# Altium schematic sheet INTERFACE_rev2.SchDoc
size A4; SheetNumber: 7; SheetTotal: 11
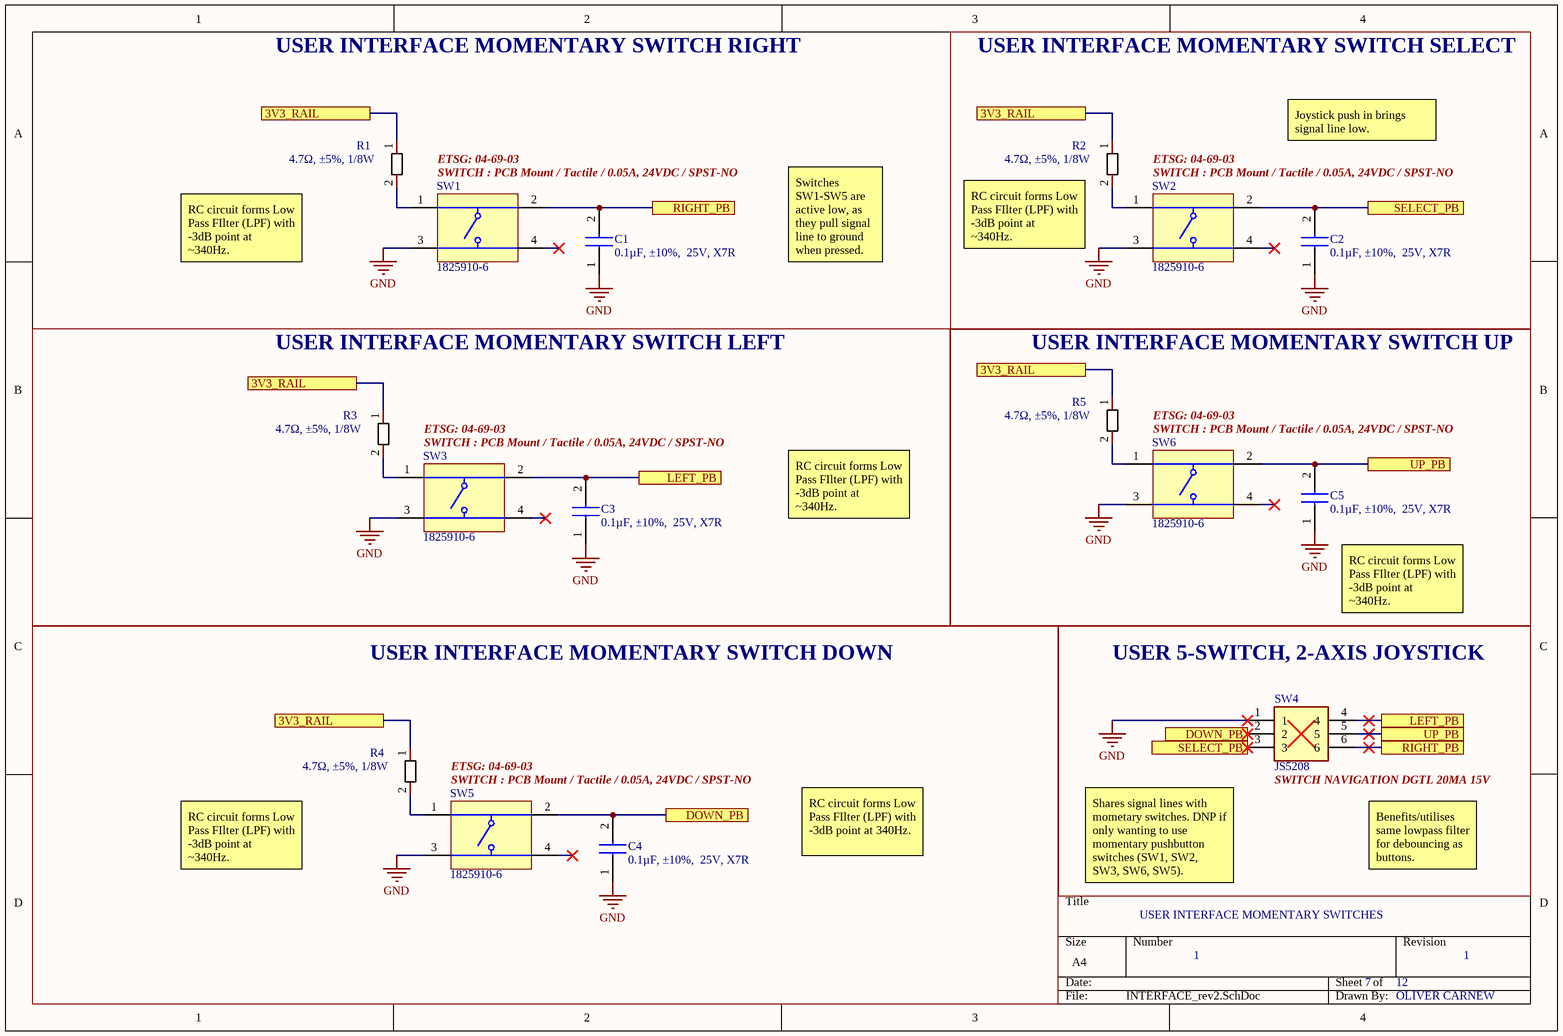
[diagram p0: INTERFACE_rev2.SchDoc]

## Parts
*  NC  (value not drawn)
C1  0.1µF, ±10%,  25V, X7R  [CAPC1005X55N]
C2  0.1µF, ±10%,  25V, X7R  [CAPC1005X55N]
C3  0.1µF, ±10%,  25V, X7R  [CAPC1005X55N]
C4  0.1µF, ±10%,  25V, X7R  [CAPC1005X55N]
C5  0.1µF, ±10%,  25V, X7R  [CAPC1005X55N]
R1  4.7Ω, ±5%, 1/8W  [SURFM RESISTOR]
R2  4.7Ω, ±5%, 1/8W  [SURFM RESISTOR]
R3  4.7Ω, ±5%, 1/8W  [SURFM RESISTOR]
R4  4.7Ω, ±5%, 1/8W  [SURFM RESISTOR]
R5  4.7Ω, ±5%, 1/8W  [SURFM RESISTOR]
SW1  1825910-6  [TECO-1825910-6_V]
SW2  1825910-6  [TECO-1825910-6_V]
SW3  1825910-6  [TECO-1825910-6_V]
SW4  JS5208  [JS5208]
SW5  1825910-6  [TECO-1825910-6_V]
SW6  1825910-6  [TECO-1825910-6_V]

## Blocks framed on the sheet
USER INTERFACE MOMENTARY SWITCH SELECT: C2 R2 SW2
USER INTERFACE MOMENTARY SWITCH LEFT: C3 R3 SW3
USER INTERFACE MOMENTARY SWITCH UP: C5 R5 SW6
USER INTERFACE MOMENTARY SWITCH DOWN: C4 R4 SW5
USER 5-SWITCH, 2-AXIS JOYSTICK: * SW4

## Ports
3V3_RAIL, DOWN_PB, LEFT_PB, RIGHT_PB, SELECT_PB, UP_PB

## Nets
GND: C1.1 C2.1 C3.1 C4.1 C5.1 SW1.3 SW2.3 SW3.3 SW4.1 SW5.3 SW6.3
3V3_RAIL: R1.1 R2.1 R3.1 R4.1 R5.1 ; port 3V3_RAIL
DOWN_PB: C4.2 SW4.2 SW5.2 ; port DOWN_PB
LEFT_PB: C3.2 SW3.2 SW4.4 ; port LEFT_PB
RIGHT_PB: C1.2 SW1.2 SW4.6 ; port RIGHT_PB
SELECT_PB: C2.2 SW2.2 SW4.3 ; port SELECT_PB
UP_PB: C5.2 SW4.5 SW6.2 ; port UP_PB
NetR1_2: R1.2 SW1.1
NetR2_2: R2.2 SW2.1
NetR3_2: R3.2 SW3.1
NetR4_2: R4.2 SW5.1
NetR5_2: R5.2 SW6.1

Not connected (* = marked no-connect by the designer): SW1 4*; SW2 4*; SW3 4*; SW5 4*; SW6 4*

## Notes on the sheet
- USER INTERFACE MOMENTARY SWITCH RIGHT
- SWITCH : PCB Mount / Tactile / 0.05A, 24VDC / SPST-NO
- ETSG: 04-69-03
- Joystick push in brings signal line low.
- (near R2) RC circuit forms Low Pass FIlter (LPF) with -3dB point at ~340Hz.
- RC circuit forms Low Pass FIlter (LPF) with -3dB point at ~340Hz.
- Switches SW1-SW5 are active low, as they pull signal line to ground when pressed.
- (near C5) RC circuit forms Low Pass FIlter (LPF) with -3dB point at ~340Hz.
- SWITCH NAVIGATION DGTL 20MA 15V
- RC circuit forms Low Pass FIlter (LPF) with -3dB point at 340Hz.
- Shares signal lines with mometary switches. DNP if only wanting to use momentary pushbutton switches (SW1, SW2, SW3, SW6, SW5).
- USER INTERFACE MOMENTARY SWITCHES
- Benefits/utilises same lowpass filter for debouncing as buttons.
- 1
- 7
- 12
- OLIVER CARNEW

## Library data of the parts
C1-C5 = CL05B104KA5NNNC: Capacitor CAP CER 0.1UF 25V X7R 0402 CL05B104KA5NNNC; Manufacturer_Name: SAMSUNG; Datasheet Link: https://datasheet.datasheetarchive.com/originals/distributors/DKDS-19/372989.pdf; Height: 0.55mm; Manufacturer_Part_Number: CL05B104KA5NNNC; Mouser Part Number: 187-CL05B104KA5NNNC; Mouser Price/Stock: https://www.mouser.co.uk/ProductDetail/Samsung-Electro-Mechanics/CL05B104KA5NNNC?qs=Efv9o2T6U88DLyyMSzjXSQ%3D%3D; Arrow Part Number: CL05B104KA5NNNC; Arrow Price/Stock: https://www.arrow.com/en/products/cl05b104ka5nnnc/samsung-electro-mechanics?region=nac; Parameter 1: Capacitor CAP CER 0.1UF 25V X7R 0402 CL05B104KA5NNNC
R1-R5 = 0805-R: Chip Resistor, 4.7 KOhm, +/- 1%, 0.1 W, -55 to 155 degC, 0603 (1608 Metric), RoHS, Tape and Reel RC0603FR-074K7L
SW1-SW3 SW5 SW6 = CMP-1684-00021-1: Tact Switch, SPST-NO, 0.05 A, -35 to 85 degC, 4-Pin THD, RoHS, Bulk; Manufacturer: TE Connectivity; Maximum Contact Resistance: 100mOhm; Mechanical Life: 100000Cycles; Bushing Type: Unthreaded; Switch Configuration: OFF(ON); Maximum DC Voltage Rating: 24V; Contact Rating @ Voltage: 0.05A@24VDC; Actuator Color: Black; Body Orientation: Straight; Function: MomentaryContact; Illumination: N/R; Actuator Style: RoundButton; Actuator Material: PolybutyleneTerephthalate; Dielectric Strength: 500VAC; Pole Throw Configuration: SPST; Actuator Length: 1.4mm; Product Weight: N/A; Contact Material: CopperAlloy; Housing Material: N/A; Terminal Type: PCPins; Minimum Insulation Resistance: 100MOhm; Package Description: 4-Pin Through Hole Device, Body 5.99 x 5.99 mm, Pitch 6.5 mm; Part No: 1825910-6; Package Reference: THD; Base Material: N/A; Manufacturer URL: http://www.te.com; Contact Plating: Silver; RoHS: Yes; Datasheet Version: Rev. C9; Electrical Life: 100000Cycles; Maximum AC Voltage Rating: N/A; Thread Size: N/R; Operating Temperature: -35to85C; Mounting: ThroughHole; Dimension: 5.99x5mm; Datasheet URL: http://www.te.com/commerce/DocumentDelivery/DDEController?Action=showdoc&DocId=Customer+Drawing%7F1825910%7FC9%7Fpdf%7FEnglish%7FENG_CD_1825910_C9.pdf%7F1825910-6; Family: 1825910; Seal Location: N/A; Seal Description: N/A; Packaging: N/A
SW4 = JS5208: Switch; Manufacturer_Name: E-Switch; Datasheet Link: https://configured-product-images.s3.amazonaws.com/2D/specs/JS5208.pdf; Height: 12.2mm; Manufacturer_Part_Number: JS5208; Mouser Part Number: 612-JS5208; Mouser Price/Stock: https://www.mouser.co.uk/ProductDetail/E-Switch/JS5208?qs=f57gQzlyLiqOzqNCAUlPQg%3D%3D